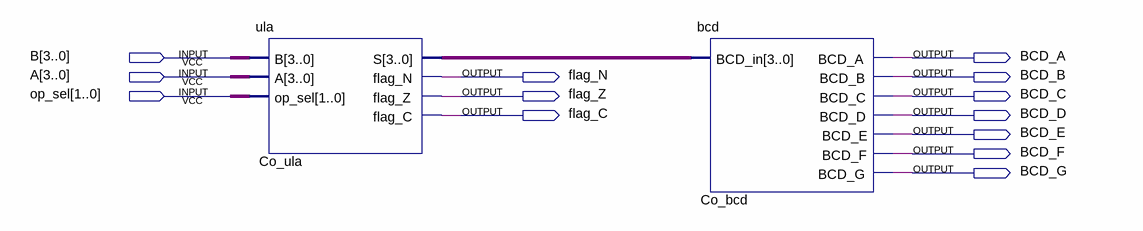
[diagram p0: schematic sheet]
// Quartus schematic lab04.bdf as structural Verilog: 2 symbols, 13 pins
module lab04 (
  input  [3:0] B,
  input  [3:0] A,
  input  [1:0] op_sel,
  output BCD_A,
  output flag_N,
  output BCD_B,
  output flag_Z,
  output BCD_C,
  output flag_C,
  output BCD_D,
  output BCD_E,
  output BCD_F,
  output BCD_G
);

  wire [3:0] Co_ula_s;

  ula Co_ula (.B(B), .A(A), .op_sel(op_sel), .S(Co_ula_s), .flag_N(flag_N), .flag_Z(flag_Z), .flag_C(flag_C));
  bcd Co_bcd (
    .BCD_in(Co_ula_s), .BCD_A(BCD_A), .BCD_B(BCD_B), .BCD_C(BCD_C), .BCD_D(BCD_D), .BCD_E(BCD_E),
    .BCD_F(BCD_F), .BCD_G(BCD_G));
endmodule
